# Altium schematic sheet BkConv_Updated.SchDoc
size A
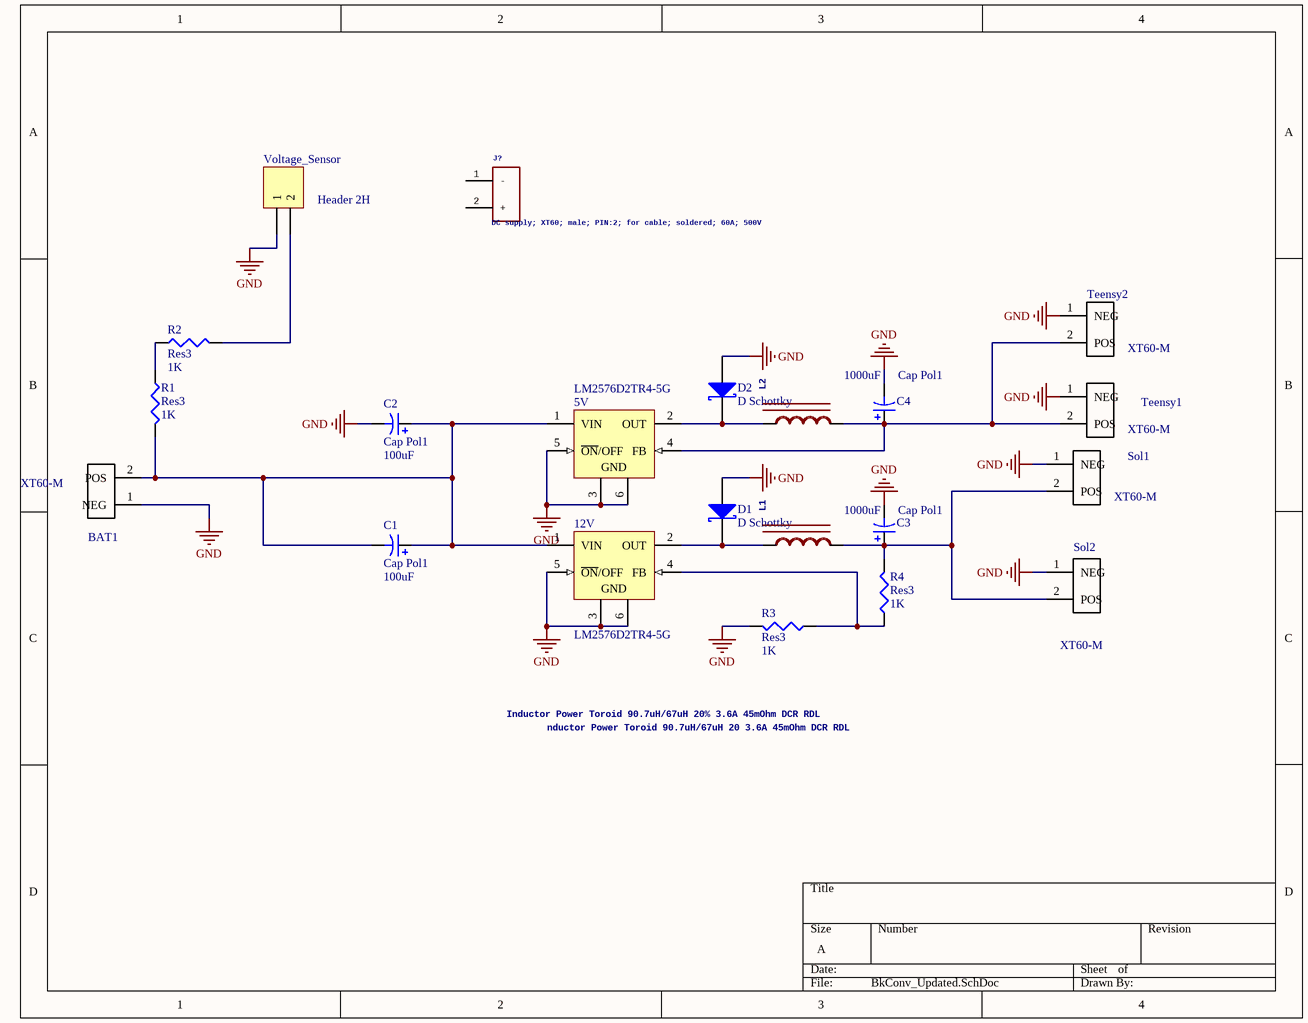
[diagram p0: BkConv_Updated.SchDoc]

## Parts
5V  LM2576D2TR4-5G  [ONSC-D2PAK-5-936A-02_V]
12V  LM2576D2TR4-5G  [ONSC-D2PAK-5-936A-02_V]
BAT1  XT60-M  [*AMASS_XT60-M]
C1  Cap Pol1  value 100uF  [RB7.6-15]
C2  Cap Pol1  value 100uF  [RB7.6-15]
C3  Cap Pol1  value 1000uF  [RB7.6-15]
C4  Cap Pol1  value 1000uF  [RB7.6-15]
D1  D Schottky  [SMB]
D2  D Schottky  [SMB]
J?  DC supply; XT60; male; PIN:2; for cable; soldered; 60A; 500V  [AMASS_XT60-M]
L1  nductor Power Toroid 90.7uH/67uH 20 3.6A 45mOhm DCR RDL  [IND_PE-92108KNL]
L2  Inductor Power Toroid 90.7uH/67uH 20% 3.6A 45mOhm DCR RDL  [IND_PE-92108KNL]
R1  Res3  value 1K  [J1-0603]
R2  Res3  value 1K  [J1-0603]
R3  Res3  value 1K  [J1-0603]
R4  Res3  value 1K  [J1-0603]
Sol1  XT60-M  [*AMASS_XT60-M]
Sol2  XT60-M  [*AMASS_XT60-M]
Teensy1  XT60-M  [*AMASS_XT60-M]
Teensy2  XT60-M  [*AMASS_XT60-M]
Voltage_Sensor  Header 2H  [HDR1X2H]

## Nets
GND: 5V.3(GND) 5V.5(~{ON}/OFF) 5V.6(GND) 12V.3(GND) 12V.5(~{ON}/OFF) 12V.6(GND) BAT1.1(NEG) C2.2 C3.2 C4.2 D1.1(A) D2.1(A) R3.2 Sol1.1(NEG) Sol2.1(NEG) Teensy1.1(NEG) Teensy2.1(NEG) Voltage_Sensor.1
Net5V_1: 5V.1(VIN) 12V.1(VIN) BAT1.2(POS) C1.1 C1.2 C2.1 R1.2
Net5V_2: 5V.2(OUT) D2.2(K) L2.1
Net5V_4: 5V.4(FB) C4.1 L2.2 Teensy1.2(POS) Teensy2.2(POS)
Net12V_2: 12V.2(OUT) D1.2(K) L1.1
Net12V_4: 12V.4(FB) R3.1 R4.1
NetC3_1: C3.1 L1.2 R4.2 Sol1.2(POS) Sol2.2(POS)
NetR1_1: R1.1 R2.1
NetR2_2: R2.2 Voltage_Sensor.2

Not connected (* = marked no-connect by the designer): J? 1(-) 2(+)

## Library data of the parts
5V 12V = CMP-1679-00008-1: Step-Down Switching Regulator, 3 A, 5 V, -40 to 125 degC, 5-Pin D2PAK (936A-02), RoHS, Tape and Reel; Frequency Tolerance: 20ppm; Load Capacitance: 18 pF; ESR: 50 Ohm; Capacitance: 1.8E-11 f; Frequency: 24 MHz; Width: 0.126 inch; Length: 0.197 inch; Package Quantity: 1000; Case/Package: CSMD; ComponentLink2URL: http://www.onsemi.com/pub_link/Collateral/LM2576-D.PDF; PackageDescription: 5-Pin Transistor Outline, Body 10.02 x 9.1945 mm, Pitch 1.702 mm; Pins: 4; Min Operating Temperature: -20degC; Packaging: Tape and Reel; Mount: Surface Mount; ComponentLink1Description: Manufacturer URL; Tolerance: 20ppm; ComponentLink2Description: Datasheet; PackageReference: D2PAK-5-936A-02; RoHSCompliant: True; DatasheetVersion: Rev. 8, 01/2006; Height: 0.043 inch; Max Operating Temperature: 70degC; Resistance: 50 Ohm; ComponentLink1URL: http://www.onsemi.com/
BAT1 Sol1 Sol2 Teensy1 Teensy2 = XT60-M: MF: AMASS; Availability: Unavailable; Price: None; MP: XT60-M; Package: Package Analog Devices; SnapEDA_Link: https://www.snapeda.com/parts/XT60-M/AMASS/view-part/?ref=snap; Value: *
C1-C4 = Cap Pol1: Polarized Capacitor (Radial); Published: 8-Jun-2000; LatestRevisionDate: 17-Jul-2002; LatestRevisionNote: Re-released for DXP Platform.; PackageReference: RB7.6-15; Publisher: Altium Limited; PackageDescription: Polarized Capacitor (Radial); 2 Leads
D1 D2 = D Schottky: Schottky Diode; Published: 8-Jun-2000; LatestRevisionDate: 17-Jul-2002; LatestRevisionNote: Re-released for DXP Platform.; PackageReference: SMB; Publisher: Altium Limited; PackageDescription: DO-214-AA/SMB; 2 C-Bend Leads; Body 5.3 x 3.6 mm, inc. leads (LxW); Code_JEDEC: DO-214-AA
J? = XT60-M: GateName_1: G$1; MF: AMASS; SymbolName_1: XT60-M; LibraryName: XT60-M; DeviceSetName: XT60-M; Package: AMASS_XT60-M; AVAILABILITY: Unavailable; MP: XT60-M; PACKAGE: Package Analog Devices; PRICE: None
L1 = PE-92108KNL: GateName_1: G$1; MF: Pulse Electronics; SymbolName_1: PE-92108KNL; LibraryName: PE-92108KNL (1); DeviceSetName: PE-92108KNL; Package: IND_PE-92108KNL; Availability: Unavailable; Price: None; Package: KM-4.0 Pulse; MP: PE-92108KNL
L2 = PE-92108KNL: MF: Pulse Electronics; SymbolName_1: PE-92108KNL; LibraryName: PE-92108KNL (1); DeviceSetName: PE-92108KNL; Package: IND_PE-92108KNL; Availability: Unavailable; Price: None; Package: KM-4.0 Pulse; MP: PE-92108KNL
R1-R4 = Res3: Resistor; Published: 8-Jun-2000; LatestRevisionDate: 29-May-2009; LatestRevisionNote: IPC-7351 Footprint Added.; PackageReference: J1-0603; Publisher: Altium Limited; PackageDescription: Chip Resistor
Voltage_Sensor = Header 2H: Header, 2-Pin, Right Angle; LatestRevisionDate: 17-Jul-2002; LatestRevisionNote: Re-released for DXP Platform.; Publisher: Altium Limited